# Altium schematic sheet Load_Tester.SchDoc
size A3; PageSetup: Record=PageOptions|CenterHorizontal=True|CenterVertical=True|PrintScale=0.68|XCorrection=1.00|YCorrection=1.00|PrintKind=1|BorderSize=5000000|LeftOffset=0|BottomOffset=0|Orientation=2|PaperLength=1000|PaperWidth=1000|Scale=100|PaperSource=7|PrintQuality=-3|MediaType=1|DitherType=10|PrintScaleMode=1|PaperKind=A1|PaperIndex=305
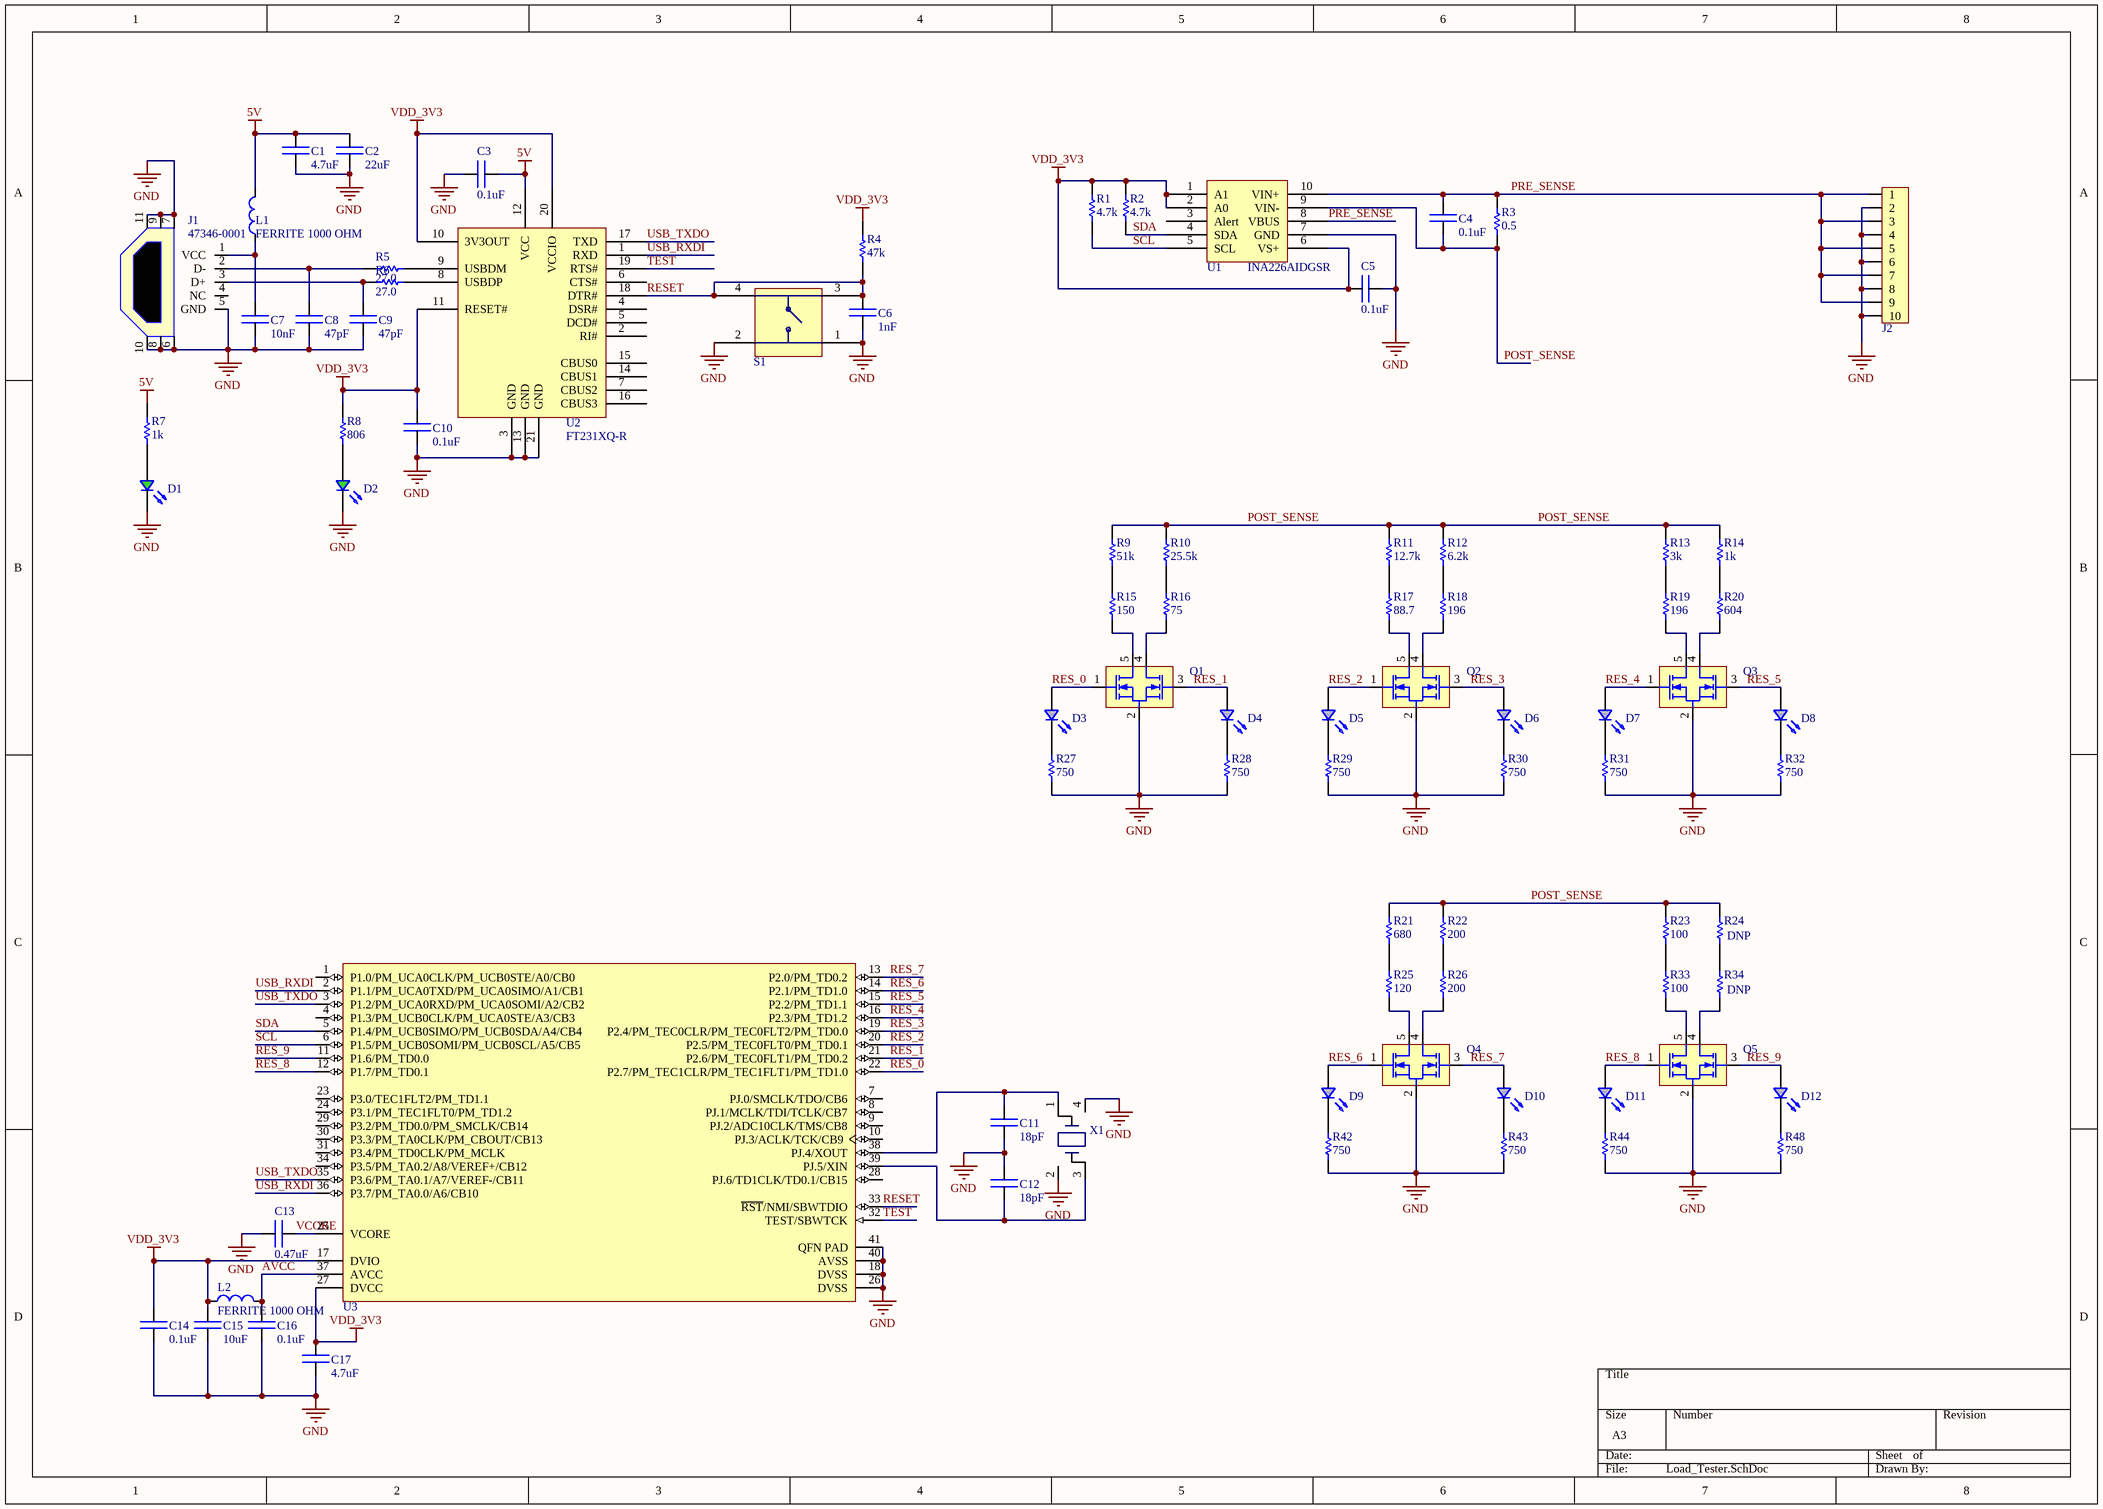
[diagram p0: Load_Tester.SchDoc]

## Parts
C1  value 4.7uF  [0603_Cap_Generic]  (hidden comment: CAP CER 4.7UF 35V X5R 0603)
C2  value 22uF  [0603_Cap_Generic]  (hidden comment: CAP CER 22UF 10V X5R 0603)
C3  value 0.1uF  [0402_CAP_Generic]  (hidden comment: CAP CER 0.1UF 25V X7R 0402)
C4  value 0.1uF  [0603_Cap_Generic]  (hidden comment: CAP CER 0.1UF 25V X7R 0603)
C5  value 0.1uF  [0402_CAP_Generic]  (hidden comment: CAP CER 0.1UF 25V X7R 0402)
C6  value 1nF  [0603_Cap_Generic]  (hidden comment: CAP CER 1000PF 50V X7R 0603)
C7  value 10nF  [0603_Cap_Generic]  (hidden comment: CAP CER 10000PF 50V X7R 0603)
C8  value 47pF  [0603_Cap_Generic]  (hidden comment: CAP CER 47PF 50V C0G 0603)
C9  value 47pF  [0603_Cap_Generic]  (hidden comment: CAP CER 47PF 50V C0G 0603)
C10  value 0.1uF  [0402_CAP_Generic]  (hidden comment: CAP CER 0.1UF 25V X7R 0402)
C11  value 18pF  [0603_Cap_Generic]  (hidden comment: CAP CER 18PF 50V C0G 0603)
C12  value 18pF  [0603_Cap_Generic]  (hidden comment: CAP CER 18PF 50V C0G 0603)
C13  value 0.47uF  [0402_CAP_Generic]  (hidden comment: CAP CER 0.47UF 10V X5R 0402)
C14  value 0.1uF  [0402_CAP_Generic]  (hidden comment: CAP CER 0.1UF 25V X7R 0402)
C15  value 10uF  [0603_Cap_Generic]  (hidden comment: CAP CER 10UF 10V JB 0603)
C16  value 0.1uF  [0402_CAP_Generic]  (hidden comment: CAP CER 0.1UF 25V X7R 0402)
C17  value 4.7uF  [0402_CAP_Generic]  (hidden comment: CAP CER 4.7UF 10V X5R 0402)
D1  LED SMARTLED GREEN 570NM 0603  [0603_LED_with_mark]  (value not drawn)
D2  LED SMARTLED GREEN 570NM 0603  [0603_LED_with_mark]  (value not drawn)
D3  LED SMARTLED RED 630NM 0603 SMD  [0603_Diode-LED_Generic]  (value not drawn)
D4  LED SMARTLED RED 630NM 0603 SMD  [0603_Diode-LED_Generic]  (value not drawn)
D5  LED SMARTLED RED 630NM 0603 SMD  [0603_Diode-LED_Generic]  (value not drawn)
D6  LED SMARTLED RED 630NM 0603 SMD  [0603_Diode-LED_Generic]  (value not drawn)
D7  LED SMARTLED RED 630NM 0603 SMD  [0603_Diode-LED_Generic]  (value not drawn)
D8  LED SMARTLED RED 630NM 0603 SMD  [0603_Diode-LED_Generic]  (value not drawn)
D9  LED SMARTLED RED 630NM 0603 SMD  [0603_Diode-LED_Generic]  (value not drawn)
D10  LED SMARTLED RED 630NM 0603 SMD  [0603_Diode-LED_Generic]  (value not drawn)
D11  LED SMARTLED RED 630NM 0603 SMD  [0603_Diode-LED_Generic]  (value not drawn)
D12  LED SMARTLED RED 630NM 0603 SMD  [0603_Diode-LED_Generic]  (value not drawn)
J1  Manufacturer Part Number: 47346-0001  [USB_MICRO_SD-47346-001]  (hidden comment: USB_MICRO-SMT-F_47346-0001)
J2  IDC BOX HEADER 0.050 10 POS  [IDC BOX HEADER 0.050 10 POS]  (value not drawn)
L1  FERRITE 1000 OHM  [FERRITE CHIP 1000 OHM 300MA 0402]
L2  FERRITE 1000 OHM  [FERRITE CHIP 1000 OHM 300MA 0402]
Q1  MOSFET 2N-CH 30V 2A TSMT5  [SOT23-5 Generic Package]  (value not drawn)
Q2  MOSFET 2N-CH 30V 2A TSMT5  [SOT23-5 Generic Package]  (value not drawn)
Q3  MOSFET 2N-CH 30V 2A TSMT5  [SOT23-5 Generic Package]  (value not drawn)
Q4  MOSFET 2N-CH 30V 2A TSMT5  [SOT23-5 Generic Package]  (value not drawn)
Q5  MOSFET 2N-CH 30V 2A TSMT5  [SOT23-5 Generic Package]  (value not drawn)
R1  value 4.7k  [0402_Res_Generic]  (hidden comment: RES SMD 4.7K OHM 1% 1/10W 0402)
R2  value 4.7k  [0402_Res_Generic]  (hidden comment: RES SMD 4.7K OHM 1% 1/10W 0402)
R3  value 0.5  [0603_Res_Generic]  (hidden comment: RES SMD 0.5 OHM 1% 1/8W 0603)
R4  value 47k  [0603_Res_Generic]  (hidden comment: RES SMD 47K OHM 1% 1/10W 0603)
R5  value 27.0  [0603_Res_Generic]  (hidden comment: RES SMD 27 OHM 1% 1/10W 0603)
R6  value 27.0  [0603_Res_Generic]  (hidden comment: RES SMD 27 OHM 1% 1/10W 0603)
R7  value 1k  [0603_Res_Generic]  (hidden comment: RES SMD 1K OHM 5% 1/10W 0603 (2))
R8  value 806  [0603_Res_Generic]  (hidden comment: RES SMD 806 OHM 1% 1/10W 0603)
R9  value 51k  [0805_Res_Generic]  (hidden comment: RES SMD 51K OHM 1% 1/8W 0805)
R10  value 25.5k  [0805_Res_Generic]  (hidden comment: RES SMD 25.5K OHM 1% 1/8W 0805)
R11  value 12.7k  [0805_Res_Generic]  (hidden comment: RES SMD 12.7K OHM 1% 1/8W 0805)
R12  value 6.2k  [0805_Res_Generic]  (hidden comment: RES SMD 6.2K OHM 1% 1/8W 0805)
R13  value 3k  [0805_Res_Generic]  (hidden comment: RES SMD 3K OHM 1% 1/8W 0805)
R14  value 1k  [0805_Res_Generic]  (hidden comment: RES SMD 1K OHM 1% 1/8W 0805)
R15  value 150  [0805_Res_Generic]  (hidden comment: RES SMD 150 OHM 1% 1/8W 0805)
R16  value 75  [0805_Res_Generic]  (hidden comment: RES SMD 75 OHM 1% 1/8W 0805)
R17  value 88.7  [0805_Res_Generic]  (hidden comment: RES SMD 88.7 OHM 1% 1/8W 0805)
R18  value 196  [0805_Res_Generic]  (hidden comment: RES SMD 196 OHM 1% 1/8W 0805)
R19  value 196  [0805_Res_Generic]  (hidden comment: RES SMD 196 OHM 1% 1/8W 0805)
R20  value 604  [0805_Res_Generic]  (hidden comment: RES SMD 604 OHM 1% 1/8W 0805)
R21  value 680  [0805_Res_Generic]  (hidden comment: RES SMD 680 OHM 1% 1/2W 0805)
R22  value 200  [0805_Res_Generic]  (hidden comment: RES SMD 200 OHM 1% 1/2W 0805)
R23  value 100  [0805_Res_Generic]  (hidden comment: RES SMD 100 OHM 0.1% 5/8W 0805)
R24  DNP  [0805_Res_Generic]
R25  value 120  [0805_Res_Generic]  (hidden comment: RES SMD 120 OHM 1% 1/2W 0805)
R26  value 200  [0805_Res_Generic]  (hidden comment: RES SMD 200 OHM 1% 1/2W 0805)
R27  value 750  [0603_Res_Generic]  (hidden comment: RES SMD 750 OHM 1% 1/10W 0603)
R28  value 750  [0603_Res_Generic]  (hidden comment: RES SMD 750 OHM 1% 1/10W 0603)
R29  value 750  [0603_Res_Generic]  (hidden comment: RES SMD 750 OHM 1% 1/10W 0603)
R30  value 750  [0603_Res_Generic]  (hidden comment: RES SMD 750 OHM 1% 1/10W 0603)
R31  value 750  [0603_Res_Generic]  (hidden comment: RES SMD 750 OHM 1% 1/10W 0603)
R32  value 750  [0603_Res_Generic]  (hidden comment: RES SMD 750 OHM 1% 1/10W 0603)
R33  value 100  [0805_Res_Generic]  (hidden comment: RES SMD 100 OHM 0.1% 5/8W 0805)
R34  DNP  [0805_Res_Generic]
R42  value 750  [0603_Res_Generic]  (hidden comment: RES SMD 750 OHM 1% 1/10W 0603)
R43  value 750  [0603_Res_Generic]  (hidden comment: RES SMD 750 OHM 1% 1/10W 0603)
R44  value 750  [0603_Res_Generic]  (hidden comment: RES SMD 750 OHM 1% 1/10W 0603)
R48  value 750  [0603_Res_Generic]  (hidden comment: RES SMD 750 OHM 1% 1/10W 0603)
S1  SWITCH TACTILE SPST-NO 0.05A 12V  [SWITCH TACTILE SPST-NO 0.05A 12V]  (value not drawn)
U1  INA226AIDGSR  [10-TFSOP]
U2  FT231XQ-R  [IC USB SERIAL FULL UART 20QFN]
U3  IC MCU 16BIT 8KB FLASH 40WQFN  [IC MCU 16BIT 8KB FLASH 40WQFN]  (value not drawn)
X1  CRYSTAL 13.56MHZ 10PF SMD  [CRYSTAL 13.56MHZ 10PF SMD]  (value not drawn)

## Nets
5V: C1.2 C2.1 C3.2 L1.2 R7.2 U2.12(VCC)
GND: C1.1 C2.2 C3.1 C5.2 C6.2 C7.2 C8.2 C9.2 C10.2 C11.2 C12.1 C13.1 C14.2 C15.2 C16.2 C17.2 D1.2 D2.2 J1.5(GND) J1.6 J1.7 J1.8 J1.9 J1.10 J1.11 J2.2 J2.4 J2.6 J2.8 J2.10 Q1.2(CS) Q2.2(CS) Q3.2(CS) Q4.2(CS) Q5.2(CS) R27.1 R28.1 R29.1 R30.1 R31.1 R32.1 R42.1 R43.1 R44.1 R48.1 S1.1 S1.2 U1.7(GND) U2.3(GND) U2.13(GND) U2.21(GND) U3.18(DVSS) U3.26(DVSS) U3.40(AVSS) U3.41(QFN_PAD) X1.2 X1.4
VDD_3V3: C5.1 C10.1 C14.1 C15.1 C17.1 L2.2 R1.2 R2.2 R4.2 R8.2 U1.1(A1) U1.2(A0) U1.6(VS+) U2.10(3V3OUT) U2.11(RESET#) U2.20(VCCIO) U3.17(DVIO) U3.27(DVCC)
AVCC: C16.1 L2.1 U3.37(AVCC)
POST_SENSE: C4.2 R3.1 R9.2 R10.2 R11.2 R12.2 R13.2 R14.2 R21.2 R22.2 R23.2 R24.2 U1.9(VIN-)
PRE_SENSE: C4.1 J2.1 J2.3 J2.5 J2.7 J2.9 R3.2 U1.8(VBUS) U1.10(VIN+)
RES_0: D3.A Q1.1(G1) U3.22(P2.7/PM_TEC1CLR/PM_TEC1FLT1/PM_TD1.0)
RES_1: D4.A Q1.3(G2) U3.21(P2.6/PM_TEC0FLT1/PM_TD0.2)
RES_2: D5.A Q2.1(G1) U3.20(P2.5/PM_TEC0FLT0/PM_TD0.1)
RES_3: D6.A Q2.3(G2) U3.19(P2.4/PM_TEC0CLR/PM_TEC0FLT2/PM_TD0.0)
RES_4: D7.A Q3.1(G1) U3.16(P2.3/PM_TD1.2)
RES_5: D8.A Q3.3(G2) U3.15(P2.2/PM_TD1.1)
RES_6: D9.A Q4.1(G1) U3.14(P2.1/PM_TD1.0)
RES_7: D10.A Q4.3(G2) U3.13(P2.0/PM_TD0.2)
RES_8: D11.A Q5.1(G1) U3.12(P1.7/PM_TD0.1)
RES_9: D12.A Q5.3(G2) U3.11(P1.6/PM_TD0.0)
RESET: C6.1 R4.1 S1.3 S1.4 U2.18(DTR#) U3.33(~{RST}/NMI/SBWTDIO)
SCL: R1.1 U1.5(SCL) U3.6(P1.5/PM_UCB0SOMI/PM_UCB0SCL/A5/CB5)
SDA: R2.1 U1.4(SDA) U3.5(P1.4/PM_UCB0SIMO/PM_UCB0SDA/A4/CB4)
TEST: U2.19(RTS#) U3.32(TEST/SBWTCK)
USB_RXDI: U2.1(RXD) U3.2(P1.1/PM_UCA0TXD/PM_UCA0SIMO/A1/CB1) U3.36(P3.7/PM_TA0.0/A6/CB10)
USB_TXDO: U2.17(TXD) U3.3(P1.2/PM_UCA0RXD/PM_UCA0SOMI/A2/CB2) U3.35(P3.6/PM_TA0.1/A7/VEREF-/CB11)
VCORE: C13.2 U3.25(VCORE)
NetC7_1: C7.1 J1.1(VCC) L1.1
NetC8_1: C8.1 J1.2(D-) R5.1
NetC9_1: C9.1 J1.3(D+) R6.1
NetC11_1: C11.1 U3.38(PJ.4/XOUT) X1.1
NetC12_2: C12.2 U3.39(PJ.5/XIN) X1.3
NetD1_1: D1.1 R7.1
NetD2_1: D2.1 R8.1
NetD3_C: D3.C R27.2
NetD4_C: D4.C R28.2
NetD5_C: D5.C R29.2
NetD6_C: D6.C R30.2
NetD7_C: D7.C R31.2
NetD8_C: D8.C R32.2
NetD9_C: D9.C R42.2
NetD10_C: D10.C R43.2
NetD11_C: D11.C R44.2
NetD12_C: D12.C R48.2
NetQ1_4: Q1.4(D2) R16.1
NetQ1_5: Q1.5(D1) R15.1
NetQ2_4: Q2.4(D2) R18.1
NetQ2_5: Q2.5(D1) R17.1
NetQ3_4: Q3.4(D2) R20.1
NetQ3_5: Q3.5(D1) R19.1
NetQ4_4: Q4.4(D2) R26.1
NetQ4_5: Q4.5(D1) R25.1
NetQ5_4: Q5.4(D2) R34.1
NetQ5_5: Q5.5(D1) R33.1
NetR5_2: R5.2 U2.9(USBDM)
NetR6_2: R6.2 U2.8(USBDP)
NetR9_1: R9.1 R15.2
NetR10_1: R10.1 R16.2
NetR11_1: R11.1 R17.2
NetR12_1: R12.1 R18.2
NetR13_1: R13.1 R19.2
NetR14_1: R14.1 R20.2
NetR21_1: R21.1 R25.2
NetR22_1: R22.1 R26.2
NetR23_1: R23.1 R33.2
NetR24_1: R24.1 R34.2

Not connected (* = marked no-connect by the designer): J1 4(NC); U1 3(Alert); U2 2(RI#) 4(DSR#) 5(DCD#) 6(CTS#) 7(CBUS2) 14(CBUS1) 15(CBUS0) 16(CBUS3); U3 1(P1.0/PM_UCA0CLK/PM_UCB0STE/A0/CB0) 4(P1.3/PM_UCB0CLK/PM_UCA0STE/A3/CB3) 7(PJ.0/SMCLK/TDO/CB6) 8(PJ.1/MCLK/TDI/TCLK/CB7) 9(PJ.2/ADC10CLK/TMS/CB8) 10(PJ.3/ACLK/TCK/CB9) 23(P3.0/TEC1FLT2/PM_TD1.1) 24(P3.1/PM_TEC1FLT0/PM_TD1.2) 28(PJ.6/TD1CLK/TD0.1/CB15) 29(P3.2/PM_TD0.0/PM_SMCLK/CB14) 30(P3.3/PM_TA0CLK/PM_CBOUT/CB13) 31(P3.4/PM_TD0CLK/PM_MCLK) 34(P3.5/PM_TA0.2/A8/VEREF+/CB12)

## Library data of the parts
C1 = 100-00191: Manufacturer: TDK; Manufacturer Part Number: C1608X5R1V475K080AC; Designator: C?; Tolerance: 10%; MC10 Part Number: 100-00191; Part Number: CAP CER 4.7UF 35V X5R 0603; Datasheet: https://product.tdk.com/info/en/catalog/datasheets/mlcc_commercial_general_en.pdf; Date Added: 2/12/2016; Drawn By: EH; Library Reference: CAP CER 4.7UF 35V X5R 0603; Supplier: Digi-Key; Supplier Part Number: 445-9064-1-ND; Verified: No; ROHS: Yes; Voltage: 35V
C2 = 100-00205: Manufacturer: TDK; Manufacturer Part Number: C1608X5R1A226M080AC; Designator: C?; Tolerance: 20%; MC10 Part Number: 100-00205; Part Number: CAP CER 22UF 10V X5R 0603; Datasheet: https://product.tdk.com/info/en/catalog/datasheets/mlcc_commercial_general_en.pdf; Date Added: 5/4/2016; Drawn By: EH; Library Reference: CAP CER 22UF 10V X5R 0603; Supplier: Digi-Key; Supplier Part Number: 445-9077-1-ND; Verified: No; ROHS: Yes; Voltage: 10V
C3 C5 C10 C14 C16 = 100-00212: Manufacturer: TDK; Manufacturer Part Number: C1005X7R1E104K050BB; Designator: C?; Tolerance: 10%; MC10 Part Number: 100-00212; Part Number: CAP CER 0.1UF 25V X7R 0402; Datasheet: https://product.tdk.com/info/en/catalog/datasheets/mlcc_commercial_general_en.pdf; Date Added: 5/18/2016; Drawn By: EH; Library Reference: CAP CER 0.1UF 25V X7R 0402; Supplier: Digi-Key; Supplier Part Number: 445-7348-1-ND; Verified: No; ROHS: Yes; Voltage: 25V
C4 = 100-00193: Manufacturer: TDK; Manufacturer Part Number: C1608X7R1E104K080AA; Designator: C?; Tolerance: 10%; MC10 Part Number: 100-00193; Part Number: CAP CER 0.1UF 25V X7R 0603; Datasheet: https://product.tdk.com/info/en/catalog/datasheets/mlcc_commercial_general_en.pdf; Date Added: 2/19/2016; Drawn By: EH; Library Reference: CAP CER 0.1UF 25V X7R 0603; Supplier: Digi-Key; Supplier Part Number: 445-1316-1-ND; Verified: No; ROHS: Yes; Voltage: 25V
C6 = 100-00211: Manufacturer: TDK; Manufacturer Part Number: C1608X7R1H102K080AE; Designator: C?; Tolerance: 10%; MC10 Part Number: 100-00211; Part Number: CAP CER 1000PF 50V X7R 0603; Datasheet: https://product.tdk.com/info/en/catalog/datasheets/mlcc_commercial_soft_en.pdf; Date Added: 5/16/2016; Drawn By: EH; Library Reference: CAP CER 1000PF 50V X7R 0603; Supplier: Digi-Key; Supplier Part Number: 445-15923-1-ND; Verified: No; ROHS: Yes; Voltage: 50V
C7 = 100-00189: Manufacturer: TDK; Manufacturer Part Number: C1608X7R1H103K080AA; Designator: C?; Tolerance: 10%; MC10 Part Number: 100-00189; Part Number: CAP CER 10000PF 50V X7R 0603; Datasheet: https://product.tdk.com/info/en/catalog/datasheets/mlcc_commercial_general_en.pdf; Date Added: 2/12/2016; Drawn By: EH; Library Reference: CAP CER 10000PF 50V X7R 0603; Supplier: Digi-Key; Supplier Part Number: 445-1311-1-ND; Verified: No; ROHS: Yes; Voltage: 50V
C8 C9 = 100-00190: Manufacturer: TDK; Manufacturer Part Number: C1608C0G1H470J080AA; Designator: C?; Tolerance: 5%; MC10 Part Number: 100-00190; Part Number: CAP CER 47PF 50V C0G 0603; Datasheet: https://product.tdk.com/info/en/catalog/datasheets/mlcc_commercial_general_en.pdf; Date Added: 2/12/2016; Drawn By: EH; Library Reference: CAP CER 47PF 50V C0G 0603; Supplier: Digi-Key; Supplier Part Number: 445-1277-1-ND; Verified: No; ROHS: n/a; Voltage: 50V
C11 C12 = 100-00209: Manufacturer: TDK; Manufacturer Part Number: CGJ3E2C0G1H180J080AA; Designator: C?; Tolerance: 5%; MC10 Part Number: 100-00209; Part Number: CAP CER 18PF 50V C0G 0603; Datasheet: https://product.tdk.com/info/en/catalog/datasheets/mlcc_highreliability_general_en.pdf; Date Added: 5/5/2016; Drawn By: EH; Library Reference: CAP CER 18PF 50V C0G 0603; Supplier: Digi-Key; Supplier Part Number: 445-13325-1-ND; Verified: No; ROHS: Yes; Voltage: 50V
C13 = 100-00214: Manufacturer: TDK; Manufacturer Part Number: C1005X5R1A474K050BB; Designator: C?; Tolerance: 10%; MC10 Part Number: 100-00214; Part Number: CAP CER 0.47UF 10V X5R 0402; Datasheet: https://product.tdk.com/info/en/catalog/datasheets/mlcc_commercial_general_en.pdf; Date Added: 5/18/2016; Drawn By: EH; Library Reference: CAP CER 0.47UF 10V X5R 0402; Supplier: Digi-Key; Supplier Part Number: 445-4989-1-ND; Verified: No; ROHS: Yes; Voltage: 10V
C15 = 100-00208: Manufacturer: TDK; Manufacturer Part Number: C1608JB1A106K080AC; Designator: C?; Tolerance: 10%; MC10 Part Number: 100-00208; Part Number: CAP CER 10UF 10V JB 0603; Datasheet: C1608JB1A106K080AC; Date Added: 5/4/2016; Drawn By: EH; Library Reference: CAP CER 10UF 10V JB 0603; Supplier: Digi-Key; Supplier Part Number: 445-11201-1-ND; Verified: No; ROHS: Yes; Voltage: 10V
C17 = 100-00213: Manufacturer: TDK; Manufacturer Part Number: C1005X5R1A475K050BC; Designator: C?; Tolerance: 10%; MC10 Part Number: 100-00213; Part Number: CAP CER 4.7UF 10V X5R 0402; Datasheet: https://product.tdk.com/info/en/catalog/datasheets/mlcc_commercial_general_en.pdf; Date Added: 5/18/2016; Drawn By: EH; Library Reference: CAP CER 4.7UF 10V X5R 0402; Supplier: Digi-Key; Supplier Part Number: 445-13820-1-ND; Verified: No; ROHS: Yes; Voltage: 10V
D1 D2 = LED SMARTLED GREEN 570NM 0603: Manufacturer: OSRAM Opto Semiconductors; Manufacturer Part Number: LG L29K-G2J1-24-Z; MC10 Part Number: 200-00073; Designator: D?; Voltage: 1.7V; Part Number: LED SMARTLED GREEN 570NM 0603; Datasheet: http://www.osram-os.com/Graphics/XPic2/00077107_0.pdf; Date Added: 9/17/2014; Drawn By: BLM; Supplier: Digi-Key; Supplier Part Number: 475-2709-1-ND; Verified: No; ROHS: n/a
D3-D12 = LED SMARTLED RED 630NM 0603 SMD: Manufacturer: OSRAM Opto Semiconductors; Manufacturer Part Number: LS L29K-H1J2-1-Z; MC10 Part Number: 200-00031; Designator: D?; Part Number: LED SMARTLED RED 630NM 0603 SMD; Datasheet: http://catalog.osram-os.com/catalogue/catalogue.do;jsessionid=E4F0AA773D08BBBBD3EF9B2D573956A2?act=downloadFile&favOid=0200000600039945000100b6; Date Added: 9/10/2013; Drawn By: BLM; Supplier: Digi-Key; Supplier Part Number: 475-1195-1-ND; Value: RED; Verified: No; ROHS: n/a
J1 = USB_MICRO-SMT-F_47346-0001: CONNECTOR MICRO USB B RECPT BTTM MOUNT ASSY; Manufacturer: Molex; MC10 Part Number: 120-00050; Designator: J?; Part Number: USB_MICRO-SMT-F_47346-0001; Datasheet: http://www.molex.com/webdocs/datasheets/pdf/en-us/0473460001_IO_CONNECTORS.pdf; Date Added: 2/10/2014; Drawn By: BKM; Supplier: Mouser; Supplier Part Number: 538-47346-0001; Value: MICRO-SMT-F; Verified: No; ROHS: n/a
J2 = IDC BOX HEADER 0.050 10 POS: Manufacturer: CNC Tech; Manufacturer Part Number: 3220-10-0300-00; MC10 Part Number: 120-00125; Designator: J?; Value: 10pos; Part Number: IDC BOX HEADER 0.050 10 POS; Datasheet: http://cnctech.us/pdfs/3220-XX-0300-00.pdf; Date Added: 5/19/2016; Drawn By: EH; Supplier: Digi-Key; Supplier Part Number: 1175-1629-ND; Verified: No; ROHS: Yes
L1 L2 = FERRITE CHIP 1000 OHM 300MA 0402: Manufacturer: Samsung; Manufacturer Part Number: CIM05U102NC; MC10 Part Number: 140-00019; Designator: Pass?; Part Number: FERRITE CHIP 1000 OHM 300MA 0402; Datasheet: http://www.samsungsem.com/global/support/library/product-catalog/__icsFiles/afieldfile/2014/11/13/Chip_Inductor.pdf; Date Added: 3/16/2015; Drawn By: AC; Supplier: Digi-Key; Supplier Part Number: 1276-6336-2-ND; Verified: Yes; ROHS: Yes
Q1-Q5 = MOSFET 2N-CH 30V 2A TSMT5: Manufacturer: Rohm Semiconductor; Manufacturer Part Number: QS5K2TR; MC10 Part Number: 200-00118; Designator: D?; Part Number: MOSFET 2N-CH 30V 2A TSMT5; Datasheet: http://rohmfs.rohm.com/en/products/databook/datasheet/discrete/transistor/mosfet/qs5k2.pdf; Date Added: 5/12/2016; Drawn By: EH; Supplier: Digi-Key; Supplier Part Number: QS5K2CT-ND; Verified: No; ROHS: Yes; Voltage: 30V
R1 R2 = RES SMD 4.7K OHM 1% 1/10W 0402: Manufacturer: Panasonic; Manufacturer Part Number: ERJ-2RKF4701X; MC10 Part Number: 110-00337; Designator: R?; Part Number: RES SMD 4.7K OHM 1% 1/10W 0402; Datasheet: http://industrial.panasonic.com/cdbs/www-data/pdf/RDA0000/AOA0000C86.pdf; Date Added: 5/18/2016; Drawn By: EH; Supplier: Digi-Key; Supplier Part Number: P4.70KLCT-ND; Verified: No; ROHS: Yes; Tolerance: 1%
R3 = RES SMD 0.5 OHM 1% 1/8W 0603: Manufacturer: Stackpole Electronics; Manufacturer Part Number: CSR0603FKR500; MC10 Part Number: 110-00355; Designator: R?; Part Number: RES SMD 0.5 OHM 1% 1/8W 0603; Datasheet: https://www.seielect.com/catalog/SEI-CSR_CSRN.pdf; Date Added: 5/23/2016; Drawn By: EH; Supplier: Digi-Key; Supplier Part Number: CSR0603FKR500CT-ND; Verified: No; ROHS: Yes; Tolerance: 1%
R4 = RES SMD 47K OHM 1% 1/10W 0603: Manufacturer: Panasonic; Manufacturer Part Number: ERJ-3EKF4702V; MC10 Part Number: 110-00336; Designator: R?; Part Number: RES SMD 47K OHM 1% 1/10W 0603; Datasheet: http://industrial.panasonic.com/cdbs/www-data/pdf/RDA0000/AOA0000C86.pdf; Date Added: 5/16/2016; Drawn By: EH; Supplier: Digi-Key; Supplier Part Number: P47.0KHCT-ND; Verified: No; ROHS: Yes; Tolerance: 1%
R5 R6 = RES SMD 27 OHM 1% 1/10W 0603: Manufacturer: Panasonic; Manufacturer Part Number: ERJ-3EKF27R0V; MC10 Part Number: 110-00300; Designator: R?; Part Number: RES SMD 27 OHM 1% 1/10W 0603; Datasheet: http://industrial.panasonic.com/ww/products/resistors/chip-resistors/chip-resistors/precision-thick-film-chip-resistors/ERJ3EKF27R0V; Date Added: 2/12/2016; Drawn By: EH; Supplier: Digi-Key; Supplier Part Number: P27.0HCT-ND; Verified: No; ROHS: Yes; Tolerance: 1%
R7 = RES SMD 1K OHM 5% 1/10W 0603 (2): RES SMD 1K OHM 5% 1/10W 0603; Manufacturer: Panasonic; Manufacturer Part Number: ERJ-3GEYJ102V; MC10 Part Number: 110-00303; Designator: R?; Part Number: RES SMD 1K OHM 5% 1/10W 0603 (2); Datasheet: http://industrial.panasonic.com/ww/products/resistors/chip-resistors/chip-resistors/thick-film-chip-resistors/ERJ3GEYJ102V; Date Added: 2/22/2016; Drawn By: EH; Supplier: Digi-Key; Supplier Part Number: P1.0KGCT-ND; Verified: No; ROHS: n/a; Tolerance: 5%
R8 = RES SMD 806 OHM 1% 1/10W 0603: Manufacturer: Panasonic; Manufacturer Part Number: ERJ-3EKF8060V; MC10 Part Number: 110-00335; Designator: R?; Part Number: RES SMD 806 OHM 1% 1/10W 0603; Datasheet: http://industrial.panasonic.com/cdbs/www-data/pdf/RDA0000/AOA0000C86.pdf; Date Added: 5/13/2016; Drawn By: EH; Supplier: Digi-Key; Supplier Part Number: P806HCT-ND; Verified: No; ROHS: Yes; Tolerance: 1%
R9 = RES SMD 51K OHM 1% 1/8W 0805: Manufacturer: Panasonic; Manufacturer Part Number: ERJ-6ENF5102V; MC10 Part Number: 110-00354; Designator: R?; Part Number: RES SMD 51K OHM 1% 1/8W 0805; Datasheet: http://industrial.panasonic.com/cdbs/www-data/pdf/RDA0000/AOA0000C86.pdf; Date Added: 5/23/2016; Drawn By: EH; Supplier: Digi-Key; Supplier Part Number: P51.0KCCT-ND; Verified: No; ROHS: Yes; Tolerance: 1%
R10 = RES SMD 25.5K OHM 1% 1/8W 0805: Manufacturer: Panasonic; Manufacturer Part Number: ERJ-6ENF2552V; MC10 Part Number: 110-00352; Designator: R?; Part Number: RES SMD 25.5K OHM 1% 1/8W 0805; Datasheet: http://industrial.panasonic.com/cdbs/www-data/pdf/RDA0000/AOA0000C86.pdf; Date Added: 5/23/2016; Drawn By: EH; Supplier: Digi-Key; Supplier Part Number: P25.5KCCT-ND; Verified: No; ROHS: Yes; Tolerance: 1%
R11 = RES SMD 12.7K OHM 1% 1/8W 0805: Manufacturer: Panasonic; Manufacturer Part Number: ERJ-6ENF1272V; MC10 Part Number: 110-00349; Designator: R?; Part Number: RES SMD 12.7K OHM 1% 1/8W 0805; Datasheet: http://industrial.panasonic.com/cdbs/www-data/pdf/RDA0000/AOA0000C86.pdf; Date Added: 5/23/2016; Drawn By: EH; Supplier: Digi-Key; Supplier Part Number: P12.7KCCT-ND; Verified: No; ROHS: Yes; Tolerance: 1%
R12 = RES SMD 6.2K OHM 1% 1/8W 0805: Manufacturer: Panasonic; Manufacturer Part Number: ERJ-6ENF6201V; MC10 Part Number: 110-00348; Designator: R?; Part Number: RES SMD 6.2K OHM 1% 1/8W 0805; Datasheet: http://industrial.panasonic.com/cdbs/www-data/pdf/RDA0000/AOA0000C86.pdf; Date Added: 5/23/2016; Drawn By: EH; Supplier: Digi-Key; Supplier Part Number: P6.20KCCT-ND; Verified: No; ROHS: Yes; Tolerance: 1%
R13 = RES SMD 3K OHM 1% 1/8W 0805: Manufacturer: Panasonic; Manufacturer Part Number: ERJ-6ENF3001V; MC10 Part Number: 110-00346; Designator: R?; Part Number: RES SMD 3K OHM 1% 1/8W 0805; Datasheet: http://industrial.panasonic.com/cdbs/www-data/pdf/RDA0000/AOA0000C86.pdf; Date Added: 5/23/2016; Drawn By: EH; Supplier: Digi-Key; Supplier Part Number: P3.0KCCT-ND; Verified: No; ROHS: Yes; Tolerance: 1%
R14 = RES SMD 1K OHM 1% 1/8W 0805: Manufacturer: Panasonic; Manufacturer Part Number: ERJ-6ENF1001V; MC10 Part Number: 110-00344; Designator: R?; Part Number: RES SMD 1K OHM 1% 1/8W 0805; Datasheet: http://industrial.panasonic.com/cdbs/www-data/pdf/RDA0000/AOA0000C86.pdf; Date Added: 5/23/2016; Drawn By: EH; Supplier: Digi-Key; Supplier Part Number: P1.00KCCT-ND; Verified: No; ROHS: Yes; Tolerance: 1%
R15 = RES SMD 150 OHM 1% 1/8W 0805: Manufacturer: Panasonic; Manufacturer Part Number: ERJ-6ENF1500V; MC10 Part Number: 110-00353; Designator: R?; Part Number: RES SMD 150 OHM 1% 1/8W 0805; Datasheet: http://industrial.panasonic.com/cdbs/www-data/pdf/RDA0000/AOA0000C86.pdf; Date Added: 5/23/2016; Drawn By: EH; Supplier: Digi-Key; Supplier Part Number: P150CCT-ND; Verified: No; ROHS: Yes; Tolerance: 1%
R16 = RES SMD 75 OHM 1% 1/8W 0805: Manufacturer: Panasonic; Manufacturer Part Number: ERJ-6ENF75R0V; MC10 Part Number: 110-00351; Designator: R?; Part Number: RES SMD 75 OHM 1% 1/8W 0805; Datasheet: http://industrial.panasonic.com/cdbs/www-data/pdf/RDA0000/AOA0000C86.pdf; Date Added: 5/23/2016; Drawn By: EH; Supplier: Digi-Key; Supplier Part Number: P75.0CCT-ND; Verified: No; ROHS: Yes; Tolerance: 1%
R17 = RES SMD 88.7 OHM 1% 1/8W 0805: Manufacturer: Panasonic; Manufacturer Part Number: ERJ-6ENF88R7V; MC10 Part Number: 110-00350; Designator: R?; Part Number: RES SMD 88.7 OHM 1% 1/8W 0805; Datasheet: http://industrial.panasonic.com/cdbs/www-data/pdf/RDA0000/AOA0000C86.pdf; Date Added: 5/23/2016; Drawn By: EH; Supplier: Digi-Key; Supplier Part Number: P88.7CCT-ND; Verified: No; ROHS: Yes; Tolerance: 1%
R18 R19 = RES SMD 196 OHM 1% 1/8W 0805: Manufacturer: Panasonic; Manufacturer Part Number: ERJ-6ENF1960V; MC10 Part Number: 110-00347; Designator: R?; Part Number: RES SMD 196 OHM 1% 1/8W 0805; Datasheet: http://industrial.panasonic.com/cdbs/www-data/pdf/RDA0000/AOA0000C86.pdf; Date Added: 5/23/2016; Drawn By: EH; Supplier: Digi-Key; Supplier Part Number: P196CCT-ND; Verified: No; ROHS: Yes; Tolerance: 1%
R20 = RES SMD 604 OHM 1% 1/8W 0805: Manufacturer: Panasonic; Manufacturer Part Number: ERJ-6ENF6040V; MC10 Part Number: 110-00343; Designator: R?; Part Number: RES SMD 604 OHM 1% 1/8W 0805; Datasheet: http://industrial.panasonic.com/cdbs/www-data/pdf/RDA0000/AOA0000C86.pdf; Date Added: 5/23/2016; Drawn By: EH; Supplier: Digi-Key; Supplier Part Number: P604CCT-ND; Verified: No; ROHS: Yes; Tolerance: 1%
R21 = RES SMD 680 OHM 1% 1/2W 0805: Manufacturer: Panasonic; Manufacturer Part Number: ERJ-P6WF6800V; MC10 Part Number: 110-00342; Designator: R?; Part Number: RES SMD 680 OHM 1% 1/2W 0805; Datasheet: http://media.digikey.com/pdf/Data%20Sheets/Panasonic%20Resistors%20Thermistors%20PDFs/ERJ-P6W_Series_NPI.pdf; Date Added: 5/23/2016; Drawn By: EH; Supplier: Digi-Key; Supplier Part Number: P16883CT-ND; Verified: No; ROHS: Yes; Tolerance: 1%
R22 R26 = RES SMD 200 OHM 1% 1/2W 0805: Manufacturer: Panasonic; Manufacturer Part Number: ERJ-P06F2000V; MC10 Part Number: 110-00340; Designator: R?; Part Number: RES SMD 200 OHM 1% 1/2W 0805; Datasheet: http://media.digikey.com/pdf/Data%20Sheets/Panasonic%20Electronic%20Components/ERJ_PA2_P03_PA3_P06_P08_P14.pdf; Date Added: 5/23/2016; Drawn By: EH; Supplier: Digi-Key; Supplier Part Number: P16064CT-ND; Verified: No; ROHS: Yes; Tolerance: 1%
R23 R33 = RES SMD 100 OHM 0.1% 5/8W 0805: Manufacturer: Vishay; Manufacturer Part Number: PHP00805E1000BST1; MC10 Part Number: 110-00339; Designator: R?; Part Number: RES SMD 100 OHM 0.1% 5/8W 0805; Datasheet: http://www.vishay.com/docs/60076/php.pdf; Date Added: 5/23/2016; Drawn By: EH; Supplier: Digi-Key; Supplier Part Number: 764-1114-1-ND; Verified: No; ROHS: Yes; Tolerance: 0.1%
R24 R34 = RES SMD 0.0 OHM JUMPER 1/8W 0805: Manufacturer: Panasonic; Manufacturer Part Number: ERJ-6GEY0R00V; MC10 Part Number: 110-00356; Value: 0.0; Designator: R?; Tolerance: JUMPER; Part Number: RES SMD 0.0 OHM JUMPER 1/8W 0805; Datasheet: http://industrial.panasonic.com/cdbs/www-data/pdf/RDA0000/AOA0000C84.pdf; Date Added: 5/23/2016; Drawn By: EH; Supplier: Digi-Key; Supplier Part Number: P0.0ACT-ND; Verified: No; ROHS: Yes
R25 = RES SMD 120 OHM 1% 1/2W 0805: Manufacturer: Panasonic; Manufacturer Part Number: ERJ-P6WF1200V; MC10 Part Number: 110-00341; Designator: R?; Part Number: RES SMD 120 OHM 1% 1/2W 0805; Datasheet: http://media.digikey.com/pdf/Data%20Sheets/Panasonic%20Resistors%20Thermistors%20PDFs/ERJ-P6W_Series_NPI.pdf; Date Added: 5/23/2016; Drawn By: EH; Supplier: Digi-Key; Supplier Part Number: P16874CT-ND; Verified: No; ROHS: Yes; Tolerance: 1%
R27-R32 R42-R44 R48 = RES SMD 750 OHM 1% 1/10W 0603: Manufacturer: Panasonic; Manufacturer Part Number: ERJ-3EKF7500V; MC10 Part Number: 110-00334; Designator: R?; Part Number: RES SMD 750 OHM 1% 1/10W 0603; Datasheet: http://industrial.panasonic.com/cdbs/www-data/pdf/RDA0000/AOA0000C86.pdf; Date Added: 5/13/2016; Drawn By: EH; Supplier: Digi-Key; Supplier Part Number: P750HCT-ND; Verified: No; ROHS: Yes; Tolerance: 1%
S1 = SWITCH TACTILE SPST-NO 0.05A 12V: Manufacturer: C&K Components; Manufacturer Part Number: PTS645SK50SMTR92 LFS; MC10 Part Number: 410-00022; Designator: S?; Part Number: SWITCH TACTILE SPST-NO 0.05A 12V; Datasheet: http://www.ck-components.com/14409/pts645_25apr13.pdf/; Date Added: 2/4/2015; Drawn By: BLM; Supplier: Digi-Key; Supplier Part Number: CKN9087CT-ND; Verified: No; ROHS: Yes
U1 = IC MONITOR PWR/CURR BIDIR 10MSOP: Manufacturer: Texas Instruments; MC10 Part Number: 202-00053; Designator: U?; Part Number: IC MONITOR PWR/CURR BIDIR 10MSOP; Datasheet: http://www.ti.com/lit/ds/symlink/ina226.pdf; Date Added: 11/24/2014; Drawn By: BLM; Manufacturer Part Number: INA226AIDGSR; Supplier: Digi-Key; Supplier Part Number: 296-29034-1-ND; Verified: No; ROHS: Yes
U2 = IC USB SERIAL FULL UART 20QFN: DNP; Manufacturer: FTDI; MC10 Part Number: 202-00069; Designator: U?; Part Number: IC USB SERIAL FULL UART 20QFN; Datasheet: http://www.ftdichip.com/Support/Documents/DataSheets/ICs/DS_FT231X.pdf; Date Added: 4/28/2015; Drawn By: BLM; Manufacturer Part Number: FT231XQ-R; Supplier: Digi-Key; Supplier Part Number: 768-1128-1-ND; Verified: No; ROHS: Yes
U3 = IC MCU 16BIT 8KB FLASH 40WQFN: DNP; Manufacturer: Texas Instruments; Manufacturer Part Number: MSP430F5132IRSBR; MC10 Part Number: 208-00018; Designator: U?; Part Number: IC MCU 16BIT 8KB FLASH 40WQFN; Datasheet: http://www.ti.com/lit/ds/symlink/msp430f5132.pdf; Date Added: 3/16/2015; Drawn By: BLM; Supplier: Digi-Key; Supplier Part Number: 296-29345-1-ND; Verified: No; ROHS: Yes
X1 = CRYSTAL 13.56MHZ 10PF SMD: Manufacturer: Abracon; Manufacturer Part Number: ABM8G-13.560MHZ-4Y-T3; MC10 Part Number: 205-00012; Designator: Y?; Value: 12.56MHz; Part Number: CRYSTAL 13.56MHZ 10PF SMD; Datasheet: http://www.abracon.com/Resonators/ABM8G.pdf; Date Added: 3/16/2015; Drawn By: BLM; Supplier: Digi-Key; Supplier Part Number: 535-10904-1-ND; Verified: No; ROHS: Yes